# EAGLE design EmonDCShieldv0.1 (EAGLE 7.7.0)
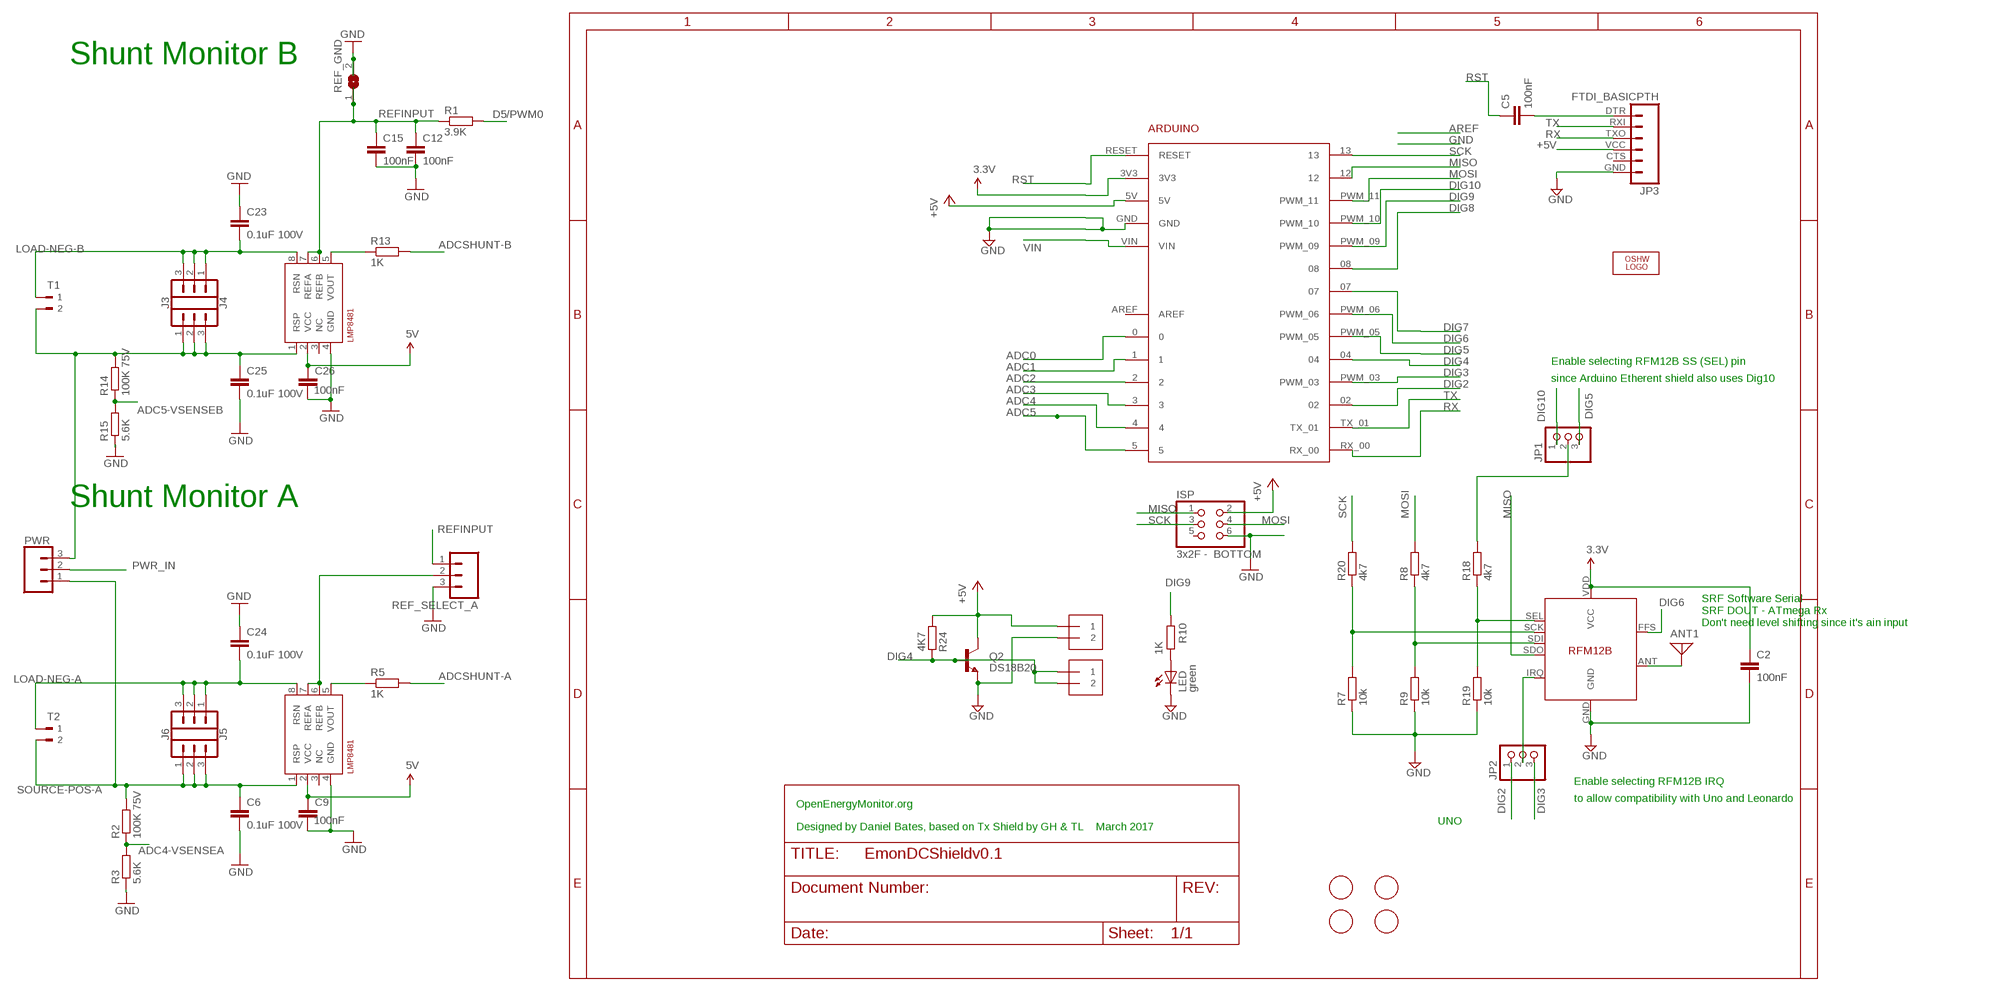
[diagram p0: schematic, sheet 1]

## Parts
ANT1  ANTENNA  [PAD-01]
ARDUINO1  ARDUINO2  [ARDUINO2]
C2  100nF  C-EUC0603  [C0603]
C5  100nF  C-EUC0603  [C0603]
C6  0.1uF 100V  C-EUC0603  [C0603]
C9  100nF  C-EUC0603  [C0603]
C12  100nF  C-EUC0603  [C0603]
C15  100nF  C-EUC0603  [C0603]
C23  0.1uF 100V  C-EUC0603  [C0603]
C24  0.1uF 100V  C-EUC0603  [C0603]
C25  0.1uF 100V  C-EUC0603  [C0603]
C26  100nF  C-EUC0603  [C0603]
ISP  3x2F - BOTTOM  PINHD-2X3  [2X03]
J1  1X2-3.5MM  [1X2-3.5MM]
J2  1X2-3.5MM  [1X2-3.5MM]
J3  CONN_03  [1X03]
J4  CONN_03  [1X03]
J5  CONN_03  [1X03]
J6  CONN_03  [1X03]
JP1  PINHD-1X3  [1X03]
JP2  PINHD-1X3  [1X03]
JP3  FTDI_BASICPTH  [FTDI_BASIC]
LED  green  LEDCHIPLED_0805  [CHIPLED_0805]
LOGO1  OSHW_LOGO_10MILX0200-NT  [OSHW_10X200_NOTEXT]
PWR  CONN_03  [1X03]
Q2  DS18B20  TRANSISTOR_NPNTO92  [TO-92]
R1  3.9K  R-EU_R0603  [R0603]
R2  100K 75V  R-EU_R0603  [R0603]
R3  5.6K  R-EU_R0603  [R0603]
R5  1K  R-EU_R0603  [R0603]
R7  10k  R-EU_R0603  [R0603]
R8  4k7  R-EU_R0603  [R0603]
R9  10k  R-EU_R0603  [R0603]
R10  1K  R-EU_R0603  [R0603]
R13  1K  R-EU_R0603  [R0603]
R14  100K 75V  R-EU_R0603  [R0603]
R15  5.6K  R-EU_R0603  [R0603]
R18  4k7  R-EU_R0603  [R0603]
R19  10k  R-EU_R0603  [R0603]
R20  4k7  R-EU_R0603  [R0603]
R24  4K7  R-EU_R0603  [R0603]
REF_GND  SJ  [SJ]
REF_SELECT_A  2212S-02SG-85  CONN_03  [1X03]
SHUNTMON-A  LMP8481  LMP8481LMP8481-H  [S-PDSO-G08]
SHUNTMON-B  LMP8481  LMP8481LMP8481-H  [S-PDSO-G08]
T1  180-2  [180-2]
T2  180-2  [180-2]
U$1  FIDUCIAL  [FIDUCIAL_1MM]
U$2  RFM12B  [RFM12B]
U$3  FIDUCIAL  [FIDUCIAL_1MM]
U$4  FIDUCIAL  [FIDUCIAL_1MM]
U$5  FIDUCIAL  [FIDUCIAL_1MM]

## Nets
3.3V [power]: ARDUINO1.3V3 C2.1 U$2.VDD(VCC)
4.7V [power]: C9.1 C26.1 SHUNTMON-A.2(VCC) SHUNTMON-B.2(VCC) ; supply symbol labelled 5V
+5V [power]: ARDUINO1.5V ISP.2 J1.1 JP3.VCC Q2.3(C) R24.1
ADC0: ARDUINO1.0
ADC1: ARDUINO1.1
ADC2: ARDUINO1.2
ADC3: ARDUINO1.3
ADC4: ARDUINO1.4
ADC4-VSENSEA: R2.1 R3.2
ADC5: ARDUINO1.5
ADC5-VSENSEB: R14.1 R15.2
ADCSHUNT-A: R5.2
ADCSHUNT-B: R13.2
D5/PWM0: R1.2
DIG2: ARDUINO1.02 JP2.1
DIG3: ARDUINO1.PWM_03 JP2.3
DIG4: ARDUINO1.04 J2.1 J2.2 Q2.2(B) R24.2
DIG5: ARDUINO1.PWM_05 JP1.3
DIG6: ARDUINO1.PWM_06 U$2.FFS
DIG7: ARDUINO1.07
DIG8: ARDUINO1.08
DIG9: ARDUINO1.PWM_09 R10.2
DIG10: ARDUINO1.PWM_10 JP1.1
GND [gnd]: ARDUINO1.GND C2.2 C6.2 C9.2 C12.2 C15.2 C23.1 C24.1 C25.2 C26.2 ISP.6 J1.2 JP3.GND LED.C Q2.1(E) R3.1 R7.1 R9.1 R15.1 R19.1 REF_GND.2 REF_SELECT_A.3 SHUNTMON-A.4(GND) SHUNTMON-B.4(GND) U$2.GND
LOAD-NEG-A: C24.2 J6.1 J6.2 J6.3 SHUNTMON-B.8(RSN) T2.1
LOAD-NEG-B: C23.2 J3.1 J3.2 J3.3 SHUNTMON-A.8(RSN) T1.1
MISO: ARDUINO1.12 ISP.1 U$2.SDO
MOSI: ARDUINO1.PWM_11 ISP.4 R8.2
N$1: JP2.2 U$2.IRQ
N$2: JP1.2 R18.2
N$3: R5.1 SHUNTMON-B.5(VOUT)
N$4: R13.1 SHUNTMON-A.5(VOUT)
N$5 [gnd]: REF_SELECT_A.2 SHUNTMON-B.6(REFB) SHUNTMON-B.7(REFA)
N$12: C5.2 JP3.DTR
N$41: LED.A R10.1
N$42: ANT1.1 U$2.ANT
N$43: R7.2 R20.1 U$2.SCK
N$44: R8.1 R9.2 U$2.SDI
N$45: R18.1 R19.2 U$2.SEL
PWR_IN: PWR.2
REFINPUT: C12.1 C15.1 R1.1 REF_GND.1 REF_SELECT_A.1 SHUNTMON-A.6(REFB) SHUNTMON-A.7(REFA)
RST: ARDUINO1.RESET C5.1
RX: ARDUINO1.RX_00 JP3.TXO
SCK: ARDUINO1.13 ISP.3 R20.2
SOURCE-POS-A: C6.1 J5.1 J5.2 J5.3 PWR.1 R2.2 SHUNTMON-B.1(RSP) T2.2
SOURCE-POS-B: C25.1 J4.1 J4.2 J4.3 PWR.3 R14.2 SHUNTMON-A.1(RSP) T1.2
TX: ARDUINO1.TX_01 JP3.RXI
VIN: ARDUINO1.VIN
Unconnected: ARDUINO1.AREF ISP.5 JP3.CTS SHUNTMON-A.3(NC) SHUNTMON-B.3(NC)

## Notes on the sheet
- Shunt Monitor B
- Enable selecting RFM12B SS (SEL) pin
- since Arduino Etherent shield also uses Dig10
- Shunt Monitor A
- SRF Software Serial
  SRF DOUT - ATmega Rx
  Don't need level shifting since it's ain input
- Enable selecting RFM12B IRQ
- to allow compatibility with Uno and Leonardo
- OpenEnergyMonitor.org
- UNO
- Designed by Daniel Bates, based on Tx Shield by GH & TL    March 2017

## Library data of the parts
ANT1 = discrete:ANTENNA: Antenna
ARDUINO1 = arduino:ARDUINO: For creating Arduino shields
C2 C5 C12 = rcl:C-EU: CAPACITOR, European symbol
C6 C9 C15 C23-C26 = rcl:C-EU: CAPACITOR, European symbol; MPN: C1608X7S2A104K080AB
ISP = pinhead:PINHD-2X3: PIN HEADER
J1 J2 = adafruit:1X2: 3.5mm Terminal block http://www.ladyada.net/library/pcb/eaglelibrary.html
J3-J6 PWR = SparkFun-Connectors:CONN_03: Multi connection point. Often used as Generic Header-pin footprint for 0.1 inch spaced/style header connections On any of the 0.1 inch spaced packages, you can populate with these: Break Away Headers - Straight <https://www.sparkfun.com/products/116> (PRT-00116) Break Away Male Headers - Right Angle <https://www.sparkfun.com/products/553> (PRT-00553) Female Headers <https://www.sparkfun.com/products/115> (PRT-00115) Break Away Headers - Machine Pin <https://www.sparkfun.com/products/117> (PRT-00117) Break Away Female Headers - Swiss Machine Pin <https://www.sparkfun.com/products/743> (PRT-00743) Stackable Header - 3 Pin (Female, 0.1") <https://www.sparkfun.com/products/13875> (PRT-13875) For SCREWTERMINALS and SPRING TERMINALS visit here: Screw Terimnals on SparkFun.com <https://www.sparkfun.com/search/results?term=Screw+Terminals> (5mm/3.5mm/2.54mm spacing) This device is also useful as a general connection point to wire up your design to another part of your project. Our various solder wires solder well into these plated through hole pads. Hook-Up Wire - Assortment (Stranded, 22 AWG) <https://www.sparkfun.com/products/11375> (PRT-11375) Hook-Up Wire - Assortment (Solid Core, 22 AWG) <https://www.sparkfun.com/products/11367> (PRT-11367) View the entire wire category on our website here <https://www.sparkfun.com/categories/141> Special notes: Molex polarized connector foot print use with SKU : PRT-08232 with associated crimp pins and housings.
JP1 JP2 = adafruit:PINHD-1X3: PIN HEADER
JP3 = SparkFun:FTDI_BASIC: FTDI Basic: 3.3V and 5V
LED = led:LED: LED OSRAM: - CHIPLED LG R971, LG N971, LY N971, LG Q971, LY Q971, LO R971, LY R971 LH N974, LH R974 LS Q976, LO Q976, LY Q976 LO Q996 - Hyper CHIPLED LW Q18S LB Q993, LB Q99A, LB R99A - SideLED LS A670, LO A670, LY A670, LG A670, LP A670 LB A673, LV A673, LT A673, LW A673 LH A674 LY A675 LS A676, LA A676, LO A676, LY A676, LW A676 LS A679, LY A679, LG A679 - Hyper Micro SIDELED® LS Y876, LA Y876, LO Y876, LY Y876 LT Y87S - SmartLED LW L88C, LW L88S LB L89C, LB L89S, LG L890 LS L89K, LO L89K, LY L89K LS L896, LA L896, LO L896, LY L896 - TOPLED LS T670, LO T670, LY T670, LG T670, LP T670 LSG T670, LSP T670, LSY T670, LOP T670, LYG T670 LG T671, LOG T671, LSG T671 LB T673, LV T673, LT T673, LW T673 LH T674 LS T676, LA T676, LO T676, LY T676, LB T676, LH T676, LSB T676, LW T676 LB T67C, LV T67C, LT T67C, LS T67K, LO T67K, LY T67K, LW E67C LS E67B, LA E67B, LO E67B, LY E67B, LB E67C, LV E67C, LT E67C LW T67C LS T679, LY T679, LG T679 LS T770, LO T770, LY T770, LG T770, LP T770 LB T773, LV T773, LT T773, LW T773 LH T774 LS E675, LA E675, LY E675, LS T675 LS T776, LA T776, LO T776, LY T776, LB T776 LHGB T686 LT T68C, LB T68C - Hyper Mini TOPLED® LB M676 - Mini TOPLED Santana® LG M470 LS M47K, LO M47K, LY M47K Source: http://www.osram.convergy.de LUXEON: - LUMILED® LXK2-PW12-R00, LXK2-PW12-S00, LXK2-PW14-U00, LXK2-PW14-V00 LXK2-PM12-R00, LXK2-PM12-S00, LXK2-PM14-U00 LXK2-PE12-Q00, LXK2-PE12-R00, LXK2-PE12-S00, LXK2-PE14-T00, LXK2-PE14-U00 LXK2-PB12-K00, LXK2-PB12-L00, LXK2-PB12-M00, LXK2-PB14-N00, LXK2-PB14-P00, LXK2-PB14-Q00 LXK2-PR12-L00, LXK2-PR12-M00, LXK2-PR14-Q00, LXK2-PR14-R00 LXK2-PD12-Q00, LXK2-PD12-R00, LXK2-PD12-S00 LXK2-PH12-R00, LXK2-PH12-S00 LXK2-PL12-P00, LXK2-PL12-Q00, LXK2-PL12-R00 Source: www.luxeon.com KINGBRIGHT: KA-3528ASYC Source: www.kingbright.com
LOGO1 = ohw-logo:OSHW_LOGO_10MIL
Q2 = SparkFun:TRANSISTOR_NPN: Transistor NPN BJT configuration in SOT23 package. MMBT2222 is the common NPN we use. Double check BCE configuration again layout.
R1 R5 R7-R10 R13 R18-R20 R24 = rcl:R-EU_: RESISTOR, European symbol
R2 R14 = rcl:R-EU_: RESISTOR, European symbol; MPN: MCWR06X1003FTL
R3 R15 = rcl:R-EU_: RESISTOR, European symbol; MPN: MCWR06X5901FTL
REF_GND = jumper:SJ: SMD solder JUMPER
REF_SELECT_A = SparkFun-Connectors:CONN_03: Multi connection point. Often used as Generic Header-pin footprint for 0.1 inch spaced/style header connections On any of the 0.1 inch spaced packages, you can populate with these: Break Away Headers - Straight <https://www.sparkfun.com/products/116> (PRT-00116) Break Away Male Headers - Right Angle <https://www.sparkfun.com/products/553> (PRT-00553) Female Headers <https://www.sparkfun.com/products/115> (PRT-00115) Break Away Headers - Machine Pin <https://www.sparkfun.com/products/117> (PRT-00117) Break Away Female Headers - Swiss Machine Pin <https://www.sparkfun.com/products/743> (PRT-00743) Stackable Header - 3 Pin (Female, 0.1") <https://www.sparkfun.com/products/13875> (PRT-13875) For SCREWTERMINALS and SPRING TERMINALS visit here: Screw Terimnals on SparkFun.com <https://www.sparkfun.com/search/results?term=Screw+Terminals> (5mm/3.5mm/2.54mm spacing) This device is also useful as a general connection point to wire up your design to another part of your project. Our various solder wires solder well into these plated through hole pads. Hook-Up Wire - Assortment (Stranded, 22 AWG) <https://www.sparkfun.com/products/11375> (PRT-11375) Hook-Up Wire - Assortment (Solid Core, 22 AWG) <https://www.sparkfun.com/products/11367> (PRT-11367) View the entire wire category on our website here <https://www.sparkfun.com/categories/141> Special notes: Molex polarized connector foot print use with SKU : PRT-08232 with associated crimp pins and housings.; MF: MULTICOMP; MPN: 2212S-02SG-85; OC_FARNELL: 1593458
SHUNTMON-A = lmp8481b:LMP8481: LMP8481MM-H/NOPB 100V/V; MF: TEXAS INSTRUMENTS; MPN: LMP8481MME-S/NOPB; OC_FARNELL: 2322044
SHUNTMON-B = lmp8481b:LMP8481: LMP8481MM-H/NOPB 100V/V; MF: TEXAS INSTRUMENTS; MPN: LMP8481MME-H/NOPB; OC_FARNELL: 2322044
T1 T2 = con-weidmueller-sl35:180-2: WEIDMUELLER CLAMP CONNECTOR; OC_FARNELL: unknown; OC_NEWARK: unknown
U$1 U$3-U$5 = adafruit:FIDUCIAL: For use by pick and place machines to calibrate the vision/machine, 1mm By microbuilder.eu
U$2 = lh-library:RFM12B

## Net classes
0 default: width 0.203 mm, drill 0.6 mm, clearance 0.203 mm
1 power: width 0.305 mm, drill 0.6 mm, clearance 0.254 mm
2 gnd: width 0.254 mm, drill 0.6 mm, clearance 0.254 mm

## Board
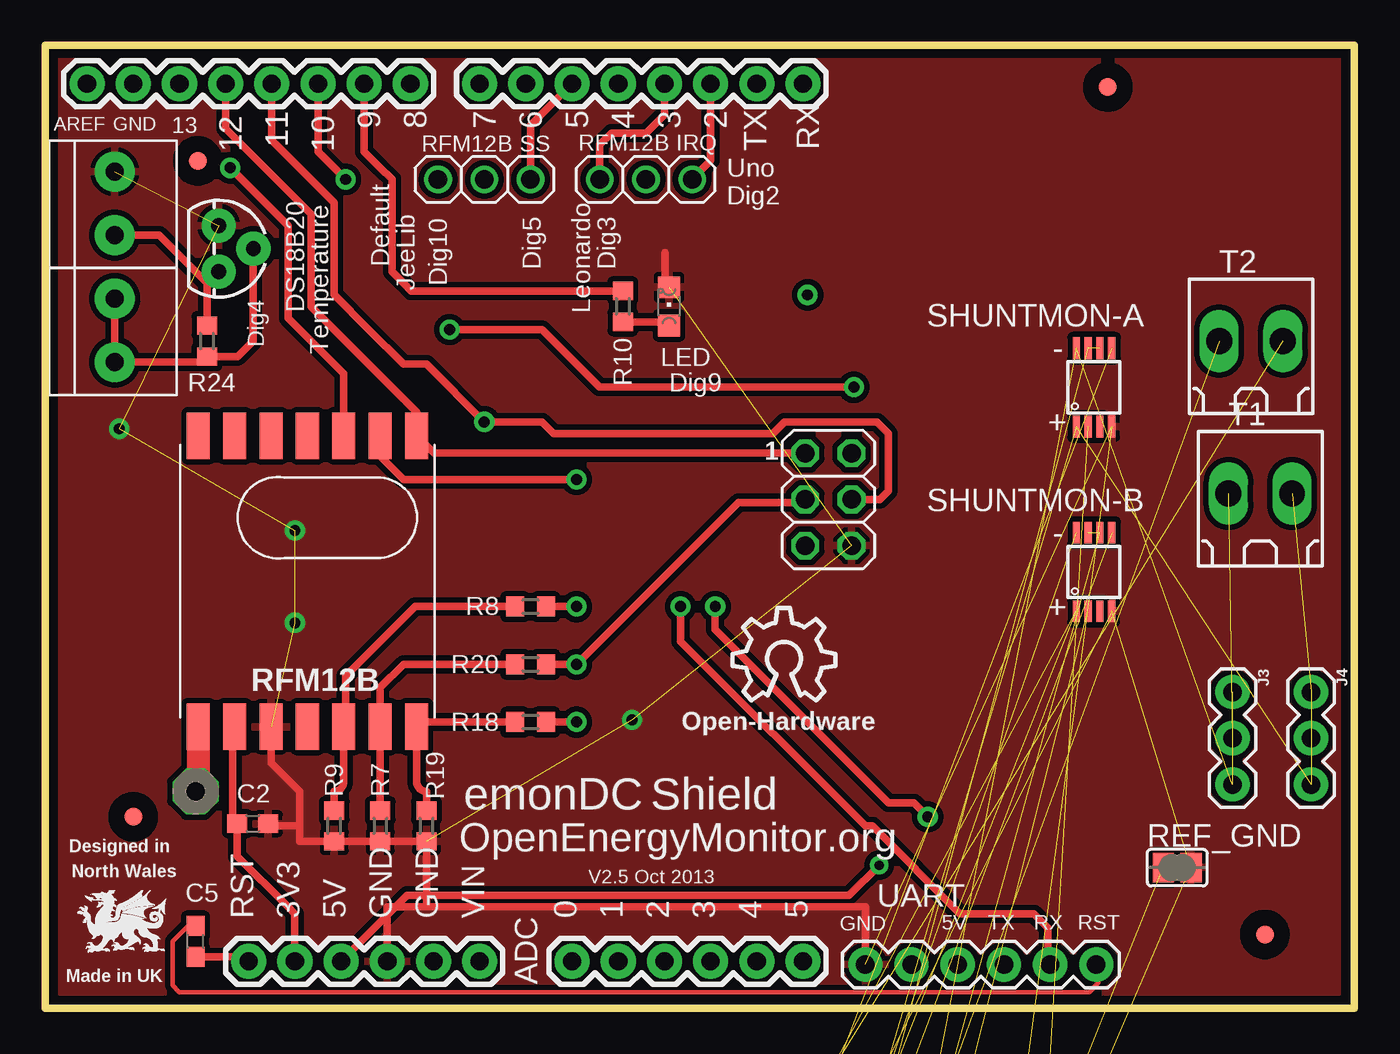
[diagram p1: board, top side]
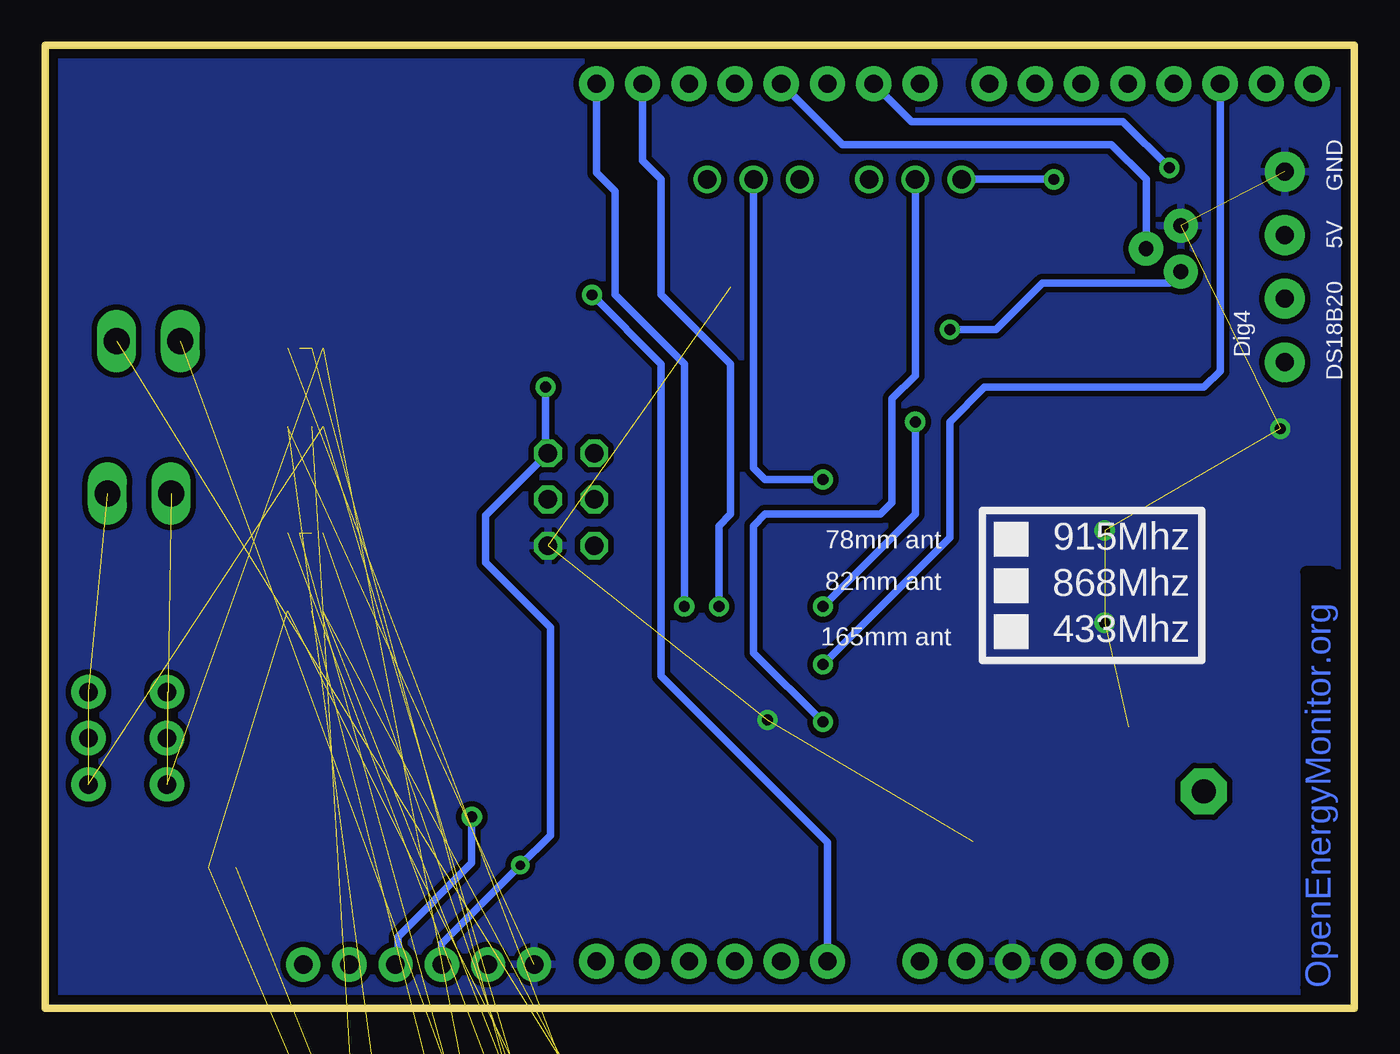
[diagram p2: board, bottom side, seen from below]

Size 71.96 x 52.95 mm. Coordinates in mm from the lower left corner, seen from the top.
Outline: 0,0 71.96,0 71.96,52.95 0,52.95 0,0
Copper layers (1*16): Top 0.035mm / dielectric 1.5mm / Bottom 0.035mm
Design rules "default": minimum track width 8mil, minimum drill 0.6mm, track to track 8mil, track to pad 10mil, pad to pad 10mil, via to via 10mil, smd to smd 10mil, copper to edge 20mil, drill to drill 16mil, minimum pad ring 10mil, minimum via ring 10mil, stop-mask expansion 0.075mm, vias tented up to drill 0.6mm, thermal gap 10mil

### Footprints (pad centres in the part's own frame; a part is rotated, then mirrored left to right if it is on the bottom)
PAD-01 = drill 1.321 pad 2.54 octagon: 1 0,0
ARDUINO2 = drill 1 pad 1.93: 0 0,12.7; 1 0,10.16; 2 0,7.62; 02 48.26,5.08; 3 0,5.08; 3V3 0,27.94; 4 0,2.54; 04 48.26,10.16; 5 0,0; 5V 0,25.4; 07 48.26,17.78; 08 48.26,21.59; 12 48.26,31.75; 13 48.26,34.29; AREF 48.26,39.37; GND 0,22.86; GND1 0,20.32; GND2 48.26,36.83; PWM_03 48.26,7.62; PWM_05 48.26,12.7; PWM_06 48.26,15.24; PWM_09 48.26,24.13; PWM_10 48.26,26.67; PWM_11 48.26,29.21; RESET 0,30.48; RX_00 48.26,0; TX_01 48.26,2.54; VIN 0,17.78
C0603 = smd 1.1 x 1: 1 -0.85,0; 2 0.85,0
2X03 = drill 1.016 octagon: 1 -2.54,-1.27; 2 -2.54,1.27; 3 0,-1.27; 4 0,1.27; 5 2.54,-1.27; 6 2.54,1.27
1X2-3.5MM = drill 1 pad 2.184: 1 1.8,0; 2 -1.7,0
1X03 = drill 1.016 pad 1.88: 1 0,0; 2 2.54,0; 3 5.08,0
1X03' = drill 1.016: 1 -2.54,0; 2 0,0; 3 2.54,0
FTDI_BASIC = drill 1.016 pad 1.88: CTS 10.16,0; DTR 0,0; GND 12.7,0; RXI 2.54,0; TXO 5.08,0; VCC 7.62,0
CHIPLED_0805 = smd 1.2 x 1.2: A 0,-1.05; C 0,1.05
TO-92 = drill 0.813 pad 1.88: 1 -1.27,0; 2 0,1.905; 3 1.27,0
R0603 = smd 1 x 1.1: 1 -0.85,0; 2 0.85,0
SJ = smd 1.168 x 1.6: 1 -0.762,0; 2 0.762,0
S-PDSO-G08 = smd 0.4 x 1.2: 1 -0.975,-2.157; 2 -0.325,-2.157; 3 0.325,-2.157; 4 0.975,-2.157; 5 0.975,2.157; 6 0.325,2.157; 7 -0.325,2.157; 8 -0.975,2.157
180-2 = drill 1.422 long: 1 -1.75,0; 2 1.75,0
FIDUCIAL_1MM = smd 1 x 1: 1 0,0
RFM12B = smd 2.54 x 1.27: ANT 8,-6; FFS -8,2; GND 8,-2; IRQ -8,4; P$8 -8,0; P$9 -8,-2; P$10 -8,-4; P$12 -8,-6; P$16 8,0; SCK 8,4; SDI 8,2; SDO -8,6; SEL 8,6; VDD 8,-4

### Placement (x,y rotation side)
ANT1  8.26,11.93 0 top
ARDUINO1  41.66,2.58 90 top
C2  11.4,10.15 0 top
C5  8.26,3.67 90 top
C6  19.05,-92.59 0 top  (outside the outline)
C9  26.42,-103.01 0 top  (outside the outline)
C12  34.29,-103.01 0 top  (outside the outline)
C15  42.16,-103.01 0 top  (outside the outline)
C23  30.99,-92.59 0 top  (outside the outline)
C24  42.93,-92.59 0 top  (outside the outline)
C25  -4.57,-103.01 0 top  (outside the outline)
C26  50.04,-103.01 0 top  (outside the outline)
ISP  43.05,27.98 270 top
J1  3.81,44.32 270 top
J2  3.81,37.33 270 top
J3  65.28,17.39 270 top
J4  69.6,17.39 270 top
J5  2.03,-61.86 0 top  (outside the outline)
J6  25.91,-61.86 0 top  (outside the outline)
JP1  [1X03']  24.13,45.59 0 top
JP2  [1X03']  33.02,45.59 180 top
JP3  57.78,2.41 180 top
LED  34.29,38.6 0 top
LOGO1  37.77,16.93 0 top
PWR  2.03,-80.65 0 top  (outside the outline)
Q2  9.53,41.77 270 top
R1  56.64,-103.01 0 top  (outside the outline)
R2  6.35,-103.01 0 top  (outside the outline)
R3  -5.84,-107.83 0 top  (outside the outline)
R5  9.14,-107.83 0 top  (outside the outline)
R7  18.41,10.03 90 top
R8  26.67,22.09 0 top
R9  15.88,10.03 90 top
R10  31.75,38.6 90 top
R13  4.32,-107.83 0 top  (outside the outline)
R14  15.75,-103.01 0 top  (outside the outline)
R15  -0.76,-107.83 0 top  (outside the outline)
R18  26.67,15.74 0 top
R19  20.95,10.03 90 top
R20  26.67,18.91 0 top
R24  8.89,36.7 270 top
REF_GND  62.23,7.74 0 top
REF_SELECT_A  25.91,-80.65 0 top  (outside the outline)
SHUNTMON-A  57.66,34.16 0 top
SHUNTMON-B  57.66,23.99 0 top
T1  66.8,28.31 0 top
T2  66.29,36.7 0 top
U$1  58.42,50.66 0 top
U$2  14.4,23.49 270 top
U$3  67.06,4.06 0 top
U$4  8.38,46.6 0 top
U$5  4.83,10.53 0 top

### Tracks (layer width: path | path; a pad name or v marks a point on that pad's centre or on a via)
3.3V
  Top 0.406: U$2.VDD 10.29,15.37 10.29,10.15 C2.1 10.55,8.36 13.34,5.58 13.72,5.2 ARDUINO1.3V3
4.7V  (3 unrouted)
+5V  (via drill 0.5, 0.6)
  Top 0.406: R24.1 8.89,39.87 | 8.89,39.87 Q2.3 | 8.89,39.87 6.25,42.52 J1.1 | v44.45,34.16 30.48,34.16 27.3,37.33 v22.23,37.33 | ARDUINO1.5V 19.89,6.21 44.2,6.21 v45.85,7.87
  Bottom 0.406: J1.1 3.81,42.41 | Q2.3 10.16,39.87 17.14,39.87 19.68,37.33 v22.23,37.33 | v44.45,34.16 44.45,30.65 ISP.2 47.75,27.09 47.75,24.5 44.2,20.95 44.2,9.52 v45.85,7.87 46.35,7.36 50.16,3.55 JP3.VCC
ADC0  (via drill 0.6)
  Bottom 0.406: ARDUINO1.0 28.96,9.14 38.1,18.28 38.1,35.43 v41.91,39.23
ADC4-VSENSEA  (1 unrouted)
ADC5-VSENSEB  (1 unrouted)
DIG2
  Top 0.406: ARDUINO1.02 36.58,46.6 JP2.1
DIG3
  Top 0.406: ARDUINO1.PWM_03 34.04,49.14 33.02,48.12 31.11,48.12 30.48,47.49 JP2.3
DIG4
  Top 0.406: J2.2 J2.1 8.57,35.53 R24.2 10.58,35.84 10.79,36.06 11.43,36.7 11.43,37.33 Q2.2
  Bottom 0.406: ARDUINO1.04 28.14,47.49 13.34,47.49 11.43,45.59 Q2.2
DIG5
  Top 0.406: ARDUINO1.PWM_05 26.67,48.56 JP1.3
DIG6  (via drill 0.6)
  Top 0.406: U$2.FFS 16.4,34.9 13.34,37.97 13.34,43.05 10.79,45.59 v10.16,46.22
  Bottom 0.406: ARDUINO1.PWM_06 24.33,48.76 13.34,48.76 12.7,48.76 v10.16,46.22
DIG9
  Top 0.406: ARDUINO1.PWM_09 17.53,47.11 18.41,46.22 19.05,45.59 19.05,40.51 19.68,39.87 20.11,39.45 R10.2
DIG10  (via drill 0.6)
  Top 0.406: ARDUINO1.PWM_10 14.99,47.11 v16.51,45.59
  Bottom 0.406: v16.51,45.59 JP1.1
GND  (via drill 0.6)  (22 unrouted)
  Top 0.406: U$2.GND 12.4,13.5 13.97,11.93 13.97,10.03 | 13.97,10.03 13.97,9.18 R9.1 R7.1 R19.1 20.95,5.58 | C2.2 12.26,10.03 13.97,10.03 | ARDUINO1.GND 18.8,5.58 20.95,5.58 | 34.08,41.56 34.08,39.87 LED.C | 20.95,5.58 45.09,5.58 JP3.GND
  other vias: 13.72,26.28 13.72,21.2 4.06,31.87 32.26,15.87
  pour Bottom (isolate 0.305): -1.27,53.84 -1.27,-2.04 73.66,-2.04 73.66,53.84
  pour Top (isolate 0.305): -1.27,53.84 73.66,53.84 73.66,-2.04 -1.27,-2.04
LOAD-NEG-A  (5 unrouted)
LOAD-NEG-B  (5 unrouted)
MISO
  Top 0.406: ISP.1 21.37,30.52 U$2.SDO 20.4,32.8 14.61,38.6 14.61,43.68 9.91,48.38 ARDUINO1.12
MOSI  (via drill 0.6)
  Top 0.406: ISP.4 45.9,27.98 46.35,28.44 46.35,31.61 45.72,32.25 40.64,32.25 40.01,31.61 27.94,31.61 27.3,32.25 v24.13,32.25 20.95,35.43 19.68,35.43 17.78,37.33 15.88,39.23 15.88,44.32 12.45,47.74 ARDUINO1.PWM_11 | R8.2 v29.21,22.09
  Bottom 0.406: v24.13,32.25 24.13,27.17 v29.21,22.09
N$1  (via drill 0.6)
  Top 0.406: U$2.IRQ 18.4,30.36 19.68,29.07 v29.21,29.07
  Bottom 0.406: v29.21,29.07 32.38,29.07 33.02,29.71 JP2.2
N$2  (via drill 0.6)
  Top 0.406: R18.2 v29.21,15.74
  Bottom 0.406: JP1.2 24.13,34.79 25.4,33.52 25.4,27.8 26.04,27.17 32.38,27.17 33.02,26.54 33.02,19.55 v29.21,15.74
N$3  (1 unrouted)
N$4  (1 unrouted)
N$5  (2 unrouted)
N$12
  Top 0.254: C5.2 7.83,4.53 6.99,3.67 6.99,1.26 7.37,0.88 57.4,0.88 57.91,1.39 57.91,2.28 JP3.DTR
N$41
  Top 0.406: R10.1 34.09,37.75 LED.A
N$42
  Top 0.406: 8.4,12.71 ANT1.1
  Top 1.27: U$2.ANT 8.4,12.71
N$43
  Top 0.406: R7.2 arc-90 18.4,10.89 U$2.SCK 18.4,17.63 19.68,18.91 R20.1
N$44
  Top 0.406: R9.2 15.88,11.93 arc90 16.4,12.46 U$2.SDI 16.51,15.6 16.51,18.28 20.32,22.09 R8.1
N$45
  Top 0.406: U$2.SEL 20.4,12.48 arc90 20.95,11.93 R19.2 | 20.4,15.74 U$2.SEL | R18.1 20.66,15.74 U$2.SEL
REFINPUT  (6 unrouted)
RST
  Top 0.406: C5.1 10.93,2.83 ARDUINO1.RESET
RX  (via drill 0.6)
  Top 0.406: v36.83,22.09 36.83,20.82 46.35,11.29 47.75,11.29 v48.51,10.53
  Bottom 0.406: ARDUINO1.RX_00 41.66,45.97 40.64,44.95 40.64,39.23 36.83,35.43 v36.83,22.09 | v48.51,10.53 48.51,7.99 52.58,3.93 52.58,2.15 52.83,1.9 52.83,2.28 JP3.TXO
SCK  (via drill 0.6)
  Top 0.406: 41.6,27.8 ISP.3 41.6,27.8 | R20.2 v29.21,18.91 38.1,27.8 41.6,27.8
  Bottom 0.406: ARDUINO1.13 7.37,35.04 8.26,34.16 20.32,34.16 22.23,32.25 22.23,25.9 v29.21,18.91
SOURCE-POS-A  (7 unrouted)
SOURCE-POS-B  (7 unrouted)
TX  (via drill 0.6)
  Top 0.406: v34.92,22.09 34.92,20.18 45.09,10.03 45.47,10.03 50.29,5.2 54.36,5.2 55.12,4.44 55.12,2.53 JP3.RXI
  Bottom 0.406: ARDUINO1.TX_01 39.12,46.6 38.1,45.59 38.1,39.23 34.92,36.06 34.29,35.43 34.29,27.17 34.92,26.54 v34.92,22.09

### Text on the board
Bottom: OpenEnergyMonitor.org
bNames: GND | 5V | Dig4 | DS18B20 | 915Mhz | 78mm ant | 868Mhz | 82mm ant | 433Mhz | 165mm ant
tSilk: TX | AREF | GND | 13 | 9 | 8 | 7 | 6 | 5 | 4 | 3 | 2 | RFM12B SS | RFM12B IRQ | 12 | 11 | 10 | RX | Uno | Default | Leonardo | Dig2 | Dig5 | Dig3 | JeeLib | Dig10 | Dig4 | Temperature | Dig9 | 1 | Open-Hardware | emonDC | Shield | Designed in | OpenEnergyMonitor.org | North Wales | V2.5 Oct 2013 | UART | RST | 3V3 | 5V | GND | GND | VIN | 0 | 1 | 2 | 3 | 4 | 5 | GND | 5V | TX | RX | RST | Made in UK | ADC
_tsilk: Designed in | North Wales | Made in UK
_bsilk: 165mm ant | 433Mhz | 165mm ant | 165mm ant | 433Mhz | 433Mhz | 868Mhz | 82mm ant | 82mm ant | 82mm ant | 868Mhz | 868Mhz | 78mm ant | 915Mhz | 78mm ant | 915Mhz | 78mm ant | 915Mhz | 165mm ant | 433Mhz | 82mm ant | 868Mhz | 78mm ant | 915Mhz